# Altium schematic sheet TP_IHM_POWER.SchDoc
size A4
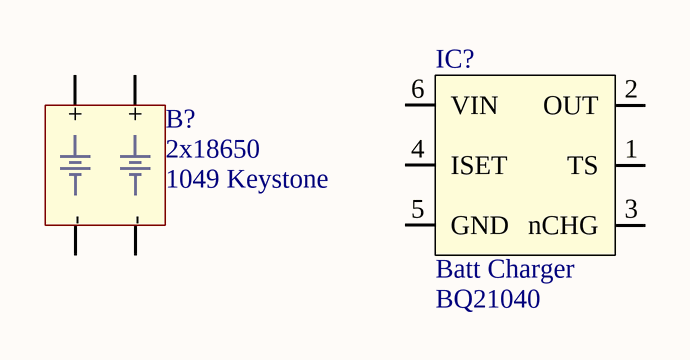
[diagram p0: TP_IHM_POWER.SchDoc]

## Parts
B?  2x18650  ref: 1049 Keystone  [KEYSTONE_1049_DUAL_18650_HOLDER]
IC?  Batt Charger  [BQ21040]

## Nets

Not connected (* = marked no-connect by the designer): B? A+(+) A-(-) B+(+) B-(-); IC? 1(TS) 2(OUT) 3(nCHG) 4(ISET) 5(GND) 6(VIN)

## Library data of the parts
B? = Dual_18650: Dual 18650 Holder
IC? = BQ21040: Single Input Single Cell Li-ion/Pol Charger; chip: BQ21040